# Altium project Brakelight_Formula.PrjPcb
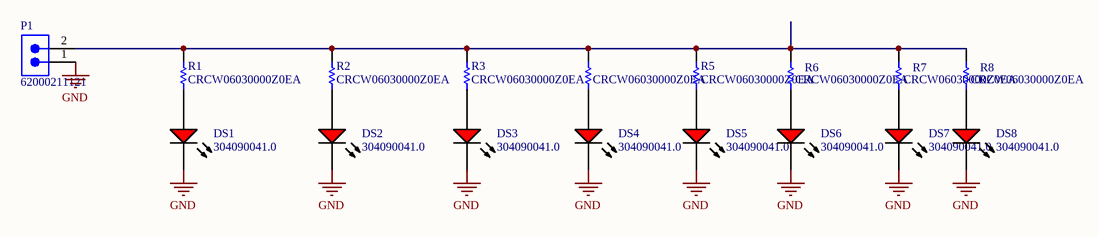
[diagram p0: Sheet1.SchDoc]
1 sheet, 17 parts. Net scope: global (net labels, ports and power ports of the same name join across sheets).
Board file: PCB1.PcbDoc

## Sheet Sheet1.SchDoc
size A4; SheetNumber: 1; SheetTotal: 1

### Parts
DS1  304090041.0  [LED-2P-2.28-3MM_A]
DS2  304090041.0  [LED-2P-2.28-3MM_A]
DS3  304090041.0  [LED-2P-2.28-3MM_A]
DS4  304090041.0  [LED-2P-2.28-3MM_A]
DS5  304090041.0  [LED-2P-2.28-3MM_A]
DS6  304090041.0  [LED-2P-2.28-3MM_A]
DS7  304090041.0  [LED-2P-2.28-3MM_A]
DS8  304090041.0  [LED-2P-2.28-3MM_A]
P1  62000211121  [62000211121]
R1  CRCW06030000Z0EA  [RESC1609X50X30NL8T20]
R2  CRCW06030000Z0EA  [RESC1609X50X30NL8T20]
R3  CRCW06030000Z0EA  [RESC1609X50X30NL8T20]
R5  CRCW06030000Z0EA  [RESC1609X50X30NL8T20]
R6  CRCW06030000Z0EA  [RESC1609X50X30NL8T20]
R7  CRCW06030000Z0EA  [RESC1609X50X30NL8T20]
R8  CRCW06030000Z0EA  [RESC1609X50X30NL8T20]
  CRCW06030000Z0EA  [RESC1609X50X30NL8T20]

### Nets
GND: DS1.2(K) DS2.2(K) DS3.2(K) DS4.2(K) DS5.2(K) DS6.2(K) DS7.2(K) DS8.2(K) P1.1
NetDS1_1: DS1.1(A) R1.1
NetDS2_1: DS2.1(A) R2.1
NetDS3_1: DS3.1(A) R3.1
NetDS4_1: DS4.1(A) .1
NetDS5_1: DS5.1(A) R5.1
NetDS6_1: DS6.1(A) R6.1
NetDS7_1: DS7.1(A) R7.1
NetDS8_1: DS8.1(A) R8.1
NetP1_2: P1.2 R1.2 R2.2 R3.2 R5.2 R6.2 R7.2 R8.2 .2

### Library data of the parts
DS1-DS8 = CMP-2100-03574-1: Red LED, 1.9 to 2.4 V, -25 to 85 degC, 2-Pin THD; Manufacturer: Shenzhen CGX; Manufacturer URL: http://szcgx.com/; Package Description: 2-Pin Through Hole Device, Dia 3 mm, Pitch 2.28 mm; Datasheet URL: http://datasheet.octopart.com/304090041-Chengguangxing-datasheet-62330656.pdf; Package Reference: 304090041.0; Datasheet Version: 41883.0
P1 = CMP-1502-00956-3: NexarPartId: 61924778; Number of Contacts: 2; Voltage Rating: 200V; Gender: Male; Contact Resistance: 20mΩ; Current Rating: 2A; Lead Pitch: 2mm; Max Operating Temperature: 105°C; Contact Material: Gold; Number of Rows: 1; Operating Supply Voltage: 200V; Number of Pins: 2; Orientation: Vertical; Min Operating Temperature: -40°C; Height: 6.35mm; RoHS: Non-Compliant
R1-R3 R5-R8  = CMP-2000-03816-5: Chip Resistor, 0 Ohm, Jumper, 100 mW, -55 to 155 degC, 0603 (1608 Metric), RoHS, Tape and Reel; Manufacturer: Vishay Semiconductor; Voltage Rating: 75 V